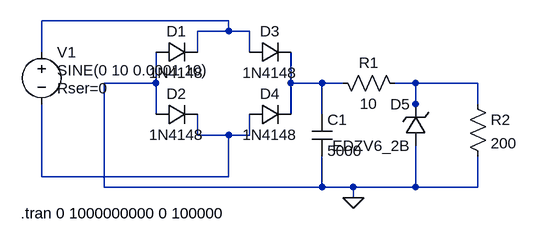
[diagram p0: schematic Assignment.asc]
Assignment.asc, the LTspice schematic file:
Version 4
SHEET 1 880 680
WIRE 272 -16 -16 -16
WIRE 272 0 272 -16
WIRE 272 0 224 0
WIRE 304 0 272 0
WIRE -16 32 -16 -16
WIRE 224 32 224 0
WIRE 304 32 304 0
WIRE 160 80 160 32
WIRE 160 80 80 80
WIRE 368 80 368 32
WIRE 416 80 368 80
WIRE 448 80 416 80
WIRE 560 80 528 80
WIRE 656 80 560 80
WIRE 560 112 560 80
WIRE 656 112 656 80
WIRE 160 128 160 80
WIRE 368 128 368 80
WIRE 416 128 416 80
WIRE 560 128 560 112
WIRE 224 160 224 128
WIRE 272 160 224 160
WIRE 304 160 304 128
WIRE 304 160 272 160
WIRE -16 224 -16 112
WIRE 272 224 272 160
WIRE 272 224 -16 224
WIRE 80 240 80 80
WIRE 416 240 416 192
WIRE 416 240 80 240
WIRE 464 240 416 240
WIRE 560 240 560 176
WIRE 560 240 464 240
WIRE 656 240 656 192
WIRE 656 240 560 240
WIRE 464 256 464 240
FLAG 464 256 0
SYMBOL diode 160 16 M90
WINDOW 0 0 32 VBottom 2
WINDOW 3 32 32 VTop 2
SYMATTR InstName D1
SYMATTR Value 1N4148
SYMBOL diode 160 112 M90
WINDOW 0 0 32 VBottom 2
WINDOW 3 32 32 VTop 2
SYMATTR InstName D2
SYMATTR Value 1N4148
SYMBOL diode 304 16 M90
WINDOW 0 0 32 VBottom 2
WINDOW 3 32 32 VTop 2
SYMATTR InstName D3
SYMATTR Value 1N4148
SYMBOL diode 304 112 M90
WINDOW 0 0 32 VBottom 2
WINDOW 3 32 32 VTop 2
SYMATTR InstName D4
SYMATTR Value 1N4148
SYMBOL voltage -16 16 R0
WINDOW 3 24 44 Left 2
WINDOW 123 0 0 Left 2
WINDOW 39 24 72 Left 2
SYMATTR Value SINE(0 10 0.0001 10)
SYMATTR SpiceLine Rser=0
SYMATTR InstName V1
SYMBOL cap 400 128 R0
SYMATTR InstName C1
SYMATTR Value 5000
SYMBOL res 432 64 M90
WINDOW 0 0 56 VBottom 2
WINDOW 3 32 56 VTop 2
SYMATTR InstName R1
SYMATTR Value 10
SYMATTR SpiceLine tol=1 pwr=0.1
SYMBOL zener 576 176 R180
WINDOW 0 24 64 Left 2
WINDOW 3 24 0 Left 2
SYMATTR InstName D5
SYMATTR Value EDZV6_2B
SYMATTR Description Diode
SYMATTR Type diode
SYMBOL res 640 96 R0
SYMATTR InstName R2
SYMATTR Value 200
TEXT -48 280 Left 2 !.tran 0 1000000000 0 100000

The netlist it stands for:
* Assignment.asc
D1 0 N001 1N4148
D2 0 N004 1N4148
D3 N001 N002 1N4148
D4 N004 N002 1N4148
V1 N001 N004 SINE(0 10 0.0001 10) Rser=0
C1 N002 0 5000
R1 N002 N003 10 tol=1 pwr=0.1
D5 0 N003 EDZV6_2B
R2 N003 0 200
.model D D
.lib standard.dio
.tran 0 1000000000 0 100000
.backanno
.end